# Altium schematic sheet Wireless.SchDoc
size A4
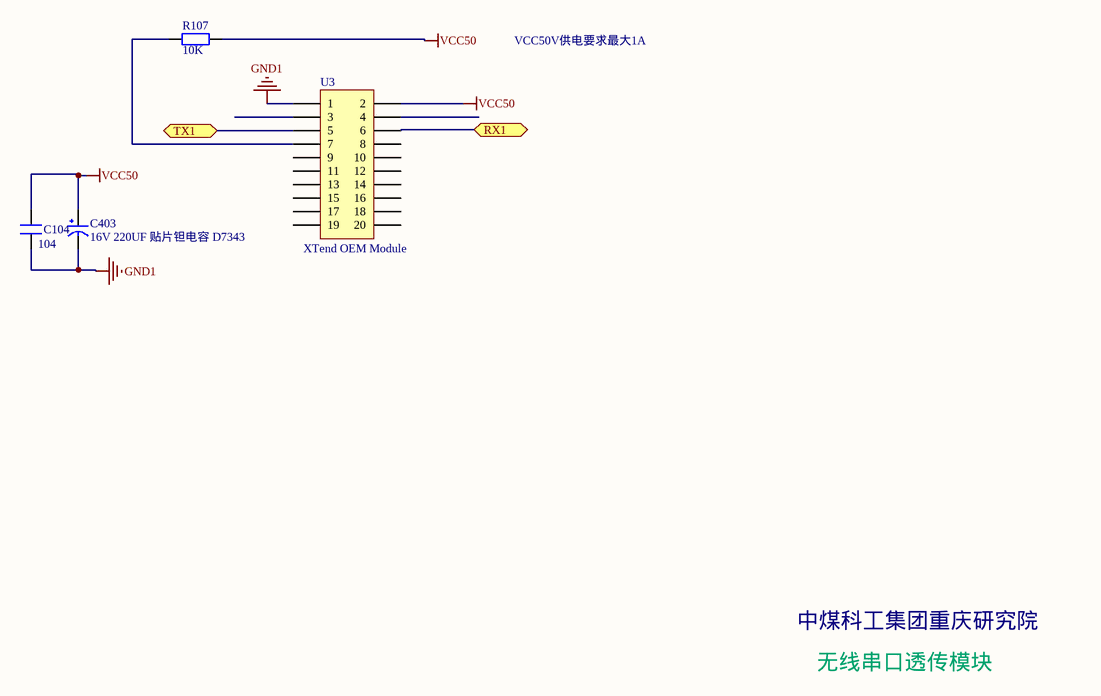
[diagram p0: Wireless.SchDoc]

## Parts
C104  104  [1206]
C403  16V 220UF 贴片钽电容 D7343  [D型7343贴片钽电容]
R107  value 10K  [1206]  (hidden comment: Res2)
U3  XTend OEM Module  [无线电台_PART_1]

## Ports
RX1 (bidir), TX1 (bidir)

## Nets
GND1: C104.1 C403.2(GND) U3.1
VCC50: C104.2 C403.1(VCC) R107.2 U3.2
RX1: U3.6 ; port RX1
TX1: U3.5 ; port TX1
NetR107_1: R107.1 U3.7

Not connected (* = marked no-connect by the designer): U3 3 4 8 9 10 11 12 13 14 15 16 17 18 19 20

## Notes on the sheet
- VCC50V供电要求最大1A
- 中煤科工集团重庆研究院
- 无线串口透传模块

## Library data of the parts
C104 = C
C403 = CAP
R107 = Res2: Resistor; Published: 8-Jun-2000; LatestRevisionDate: 17-Jul-2002; LatestRevisionNote: Re-released for DXP Platform.; PackageReference: AXIAL-0.4; Publisher: Altium Limited
U3 = Header 10X2: Header, 10-Pin, Dual row; LatestRevisionDate: 17-Jul-2002; LatestRevisionNote: Re-released for DXP Platform.; Publisher: Altium Limited